# Altium schematic sheet drive_circuit.SchDoc
size A; SheetNumber: 1; SheetTotal: 1
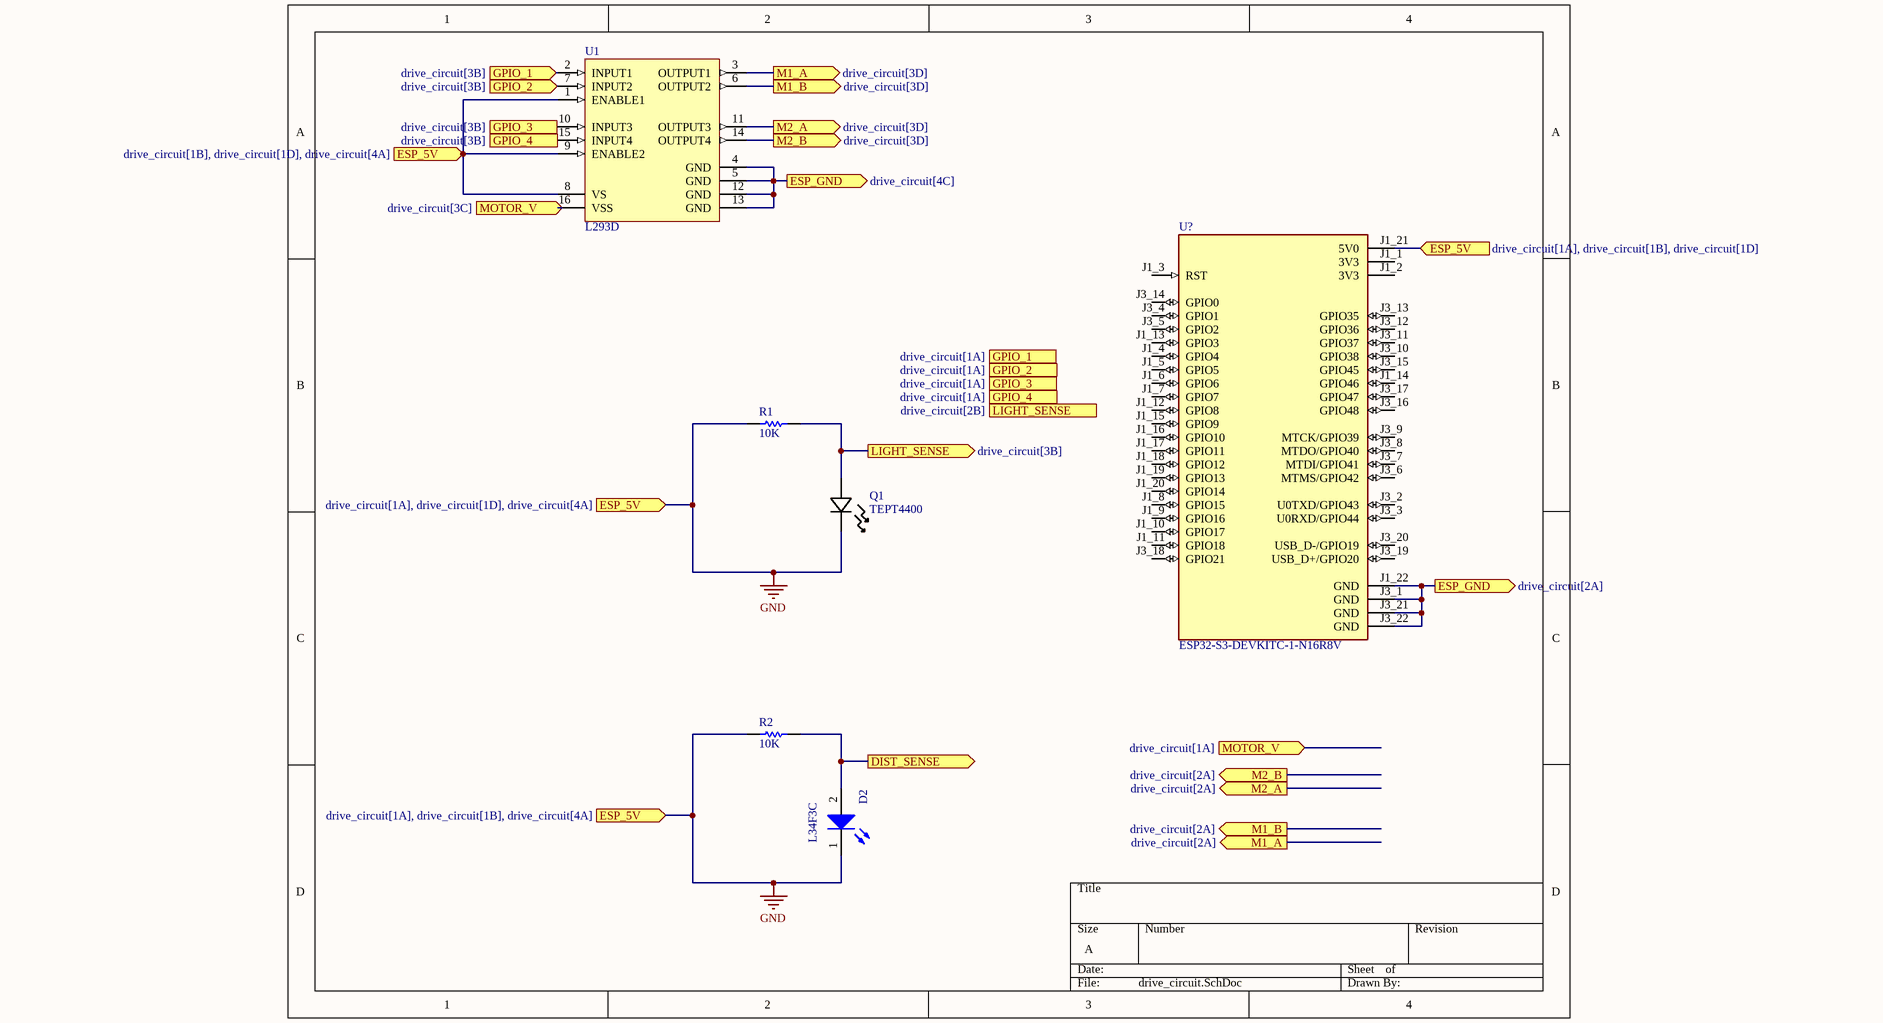
[diagram p0: drive_circuit.SchDoc]

## Parts
D2  L34F3C  [WL-TIRW_D3.9H5.3]
Q1  TEPT4400  [LED_TEPT4400_VIS]
R1  value 10K  (hidden comment: Resistor)
R2  value 10K  (hidden comment: Resistor)
U1  L293D  [STM-L293D-16]
U?  ESP32-S3-DEVKITC-1-N16R8V  [XCVR_ESP32-S3-DEVKITC-1-N16R8V]

## Ports
DIST_SENSE (out), ESP_5V (in, see drive_circuit[1A], drive_circuit[1B], drive_circuit[1D]), ESP_5V (in, see drive_circuit[1A], drive_circuit[1B], drive_circuit[4A]), ESP_5V (in, see drive_circuit[1A], drive_circuit[1D], drive_circuit[4A]), ESP_5V (in, see drive_circuit[1B], drive_circuit[1D], drive_circuit[4A]), ESP_GND (out, see drive_circuit[2A]), ESP_GND (out, see drive_circuit[4C]), GPIO_1 (in, see drive_circuit[1A]), GPIO_1 (in, see drive_circuit[3B]), GPIO_2 (in, see drive_circuit[1A]), GPIO_2 (in, see drive_circuit[3B]), GPIO_3 (see drive_circuit[1A]), GPIO_3 (see drive_circuit[3B]), GPIO_4 (see drive_circuit[1A]), GPIO_4 (see drive_circuit[3B]), LIGHT_SENSE (out, see drive_circuit[2B]), LIGHT_SENSE (out, see drive_circuit[3B]), M1_A (out, see drive_circuit[2A]), M1_A (out, see drive_circuit[3D]), M1_B (out, see drive_circuit[2A]), M1_B (out, see drive_circuit[3D]), M2_A (out, see drive_circuit[2A]), M2_A (out, see drive_circuit[3D]), M2_B (out, see drive_circuit[2A]), M2_B (out, see drive_circuit[3D]), MOTOR_V (in, see drive_circuit[1A]), MOTOR_V (in, see drive_circuit[3C])

## Nets
GND: D2.1(K) Q1.1 R1.1 R2.1 U1.1(ENABLE1) U1.8(VS) U1.9(ENABLE2) U?.J1_21(5V0) ; port ESP_5V
DIST_SENSE: D2.2(A) R2.2 ; port DIST_SENSE
ESP_GND: U1.4(GND) U1.5(GND) U1.12(GND) U1.13(GND) U?.J1_22(GND) U?.J3_1(GND) U?.J3_21(GND) U?.J3_22(GND) ; port ESP_GND
GPIO_1: U1.2(INPUT1) ; port GPIO_1
GPIO_2: U1.7(INPUT2) ; port GPIO_2
GPIO_4: U1.15(INPUT4) ; port GPIO_4
LIGHT_SENSE: Q1.2 R1.2 ; port LIGHT_SENSE
M1_A: U1.3(OUTPUT1) ; port M1_A
M1_B: U1.6(OUTPUT2) ; port M1_B
M2_A: U1.11(OUTPUT3) ; port M2_A
M2_B: U1.14(OUTPUT4) ; port M2_B
MOTOR_V: U1.16(VSS) ; port MOTOR_V

Not connected (* = marked no-connect by the designer): U1 10(INPUT3); U? J1_1(3V3) J1_2(3V3) J1_3(RST) J1_4(GPIO4) J1_5(GPIO5) J1_6(GPIO6) J1_7(GPIO7) J1_8(GPIO15) J1_9(GPIO16) J1_10(GPIO17) J1_11(GPIO18) J1_12(GPIO8) J1_13(GPIO3) J1_14(GPIO46) J1_15(GPIO9) J1_16(GPIO10) J1_17(GPIO11) J1_18(GPIO12) J1_19(GPIO13) J1_20(GPIO14) J3_2(U0TXD/GPIO43) J3_3(U0RXD/GPIO44) J3_4(GPIO1) J3_5(GPIO2) J3_6(MTMS/GPIO42) J3_7(MTDI/GPIO41) J3_8(MTDO/GPIO40) J3_9(MTCK/GPIO39) J3_10(GPIO38) J3_11(GPIO37) J3_12(GPIO36) J3_13(GPIO35) J3_14(GPIO0) J3_15(GPIO45) J3_16(GPIO48) J3_17(GPIO47) J3_18(GPIO21) J3_19(USB_D+/GPIO20) J3_20(USB_D-/GPIO19)

## Library data of the parts
D2 = CMP-03913-82270983-2: WL-TIRW THT Infrared Round Waterclear; Manufacturer Lifecycle Status: ACTIVE; Forward Current: 1A; Wavelength: 850nm; YEOL: 1 = Estimated lifetime > 10 years; Viewing Angle: 35°; Max Reverse Voltage (DC): 5V; Forward Voltage: 1.5V; Length: 3mm; Width: 2.54mm; Height: 5.3mm; Peak Wavelength: 850nm; RoHS: Compliant; Max Operating Temperature: 85°C; Min Operating Temperature: -40°C; Lifecycle Status: Production; Packaging: Bulk
Q1 = TEPT4400: PHOTO TRANS. 3MM  30DEG-e4; Manufacturer_Name: Vishay; Copyright: Copyright (C) 2026 Ultra Librarian. All rights reserved.; Manufacturer_Part_Number: TEPT4400; Datasheet: https://www.vishay.com/doc?81341
R1 R2 = Resistor: TC1: 0; SimulationGenericComponent: True; TC2: 0
U1 = CMP-2000-06524-1: Push-Pull Four Channel Driver with Diode, 4.5 to 36 V, -40 to 150 degC, 16-Pin PDIP, RoHS, Tube; Manufacturer: STMicroelectronics; Number of Outputs: 4; Current - Peak Output: 1.2A; Current - Output / Channel: 600mA; Input Type: Non-Inverting; Other Related Documents: L293DViewAllSpecifications; Dynamic Catalog: HalfBridge; Voltage - Supply: 4.5V~36V; Other Names: 497-2936-5; Package / Case: 16-DIP(0.300",7.62mm); PartNumber: L293D; Operating Temperature: -40°C~150°C; Datasheet URL: http://www.st.com/st-web-ui/static/active/en/resource/technical/document/datasheet/CD00000059.pdf; Supplier Device Package: 16-PowerDIP; Packaging: Tube; Package Description: 16-Pin Thru-Hole Dual-In-Line, Body 20 x 6.85 mm, Pitch 2.54 mm; Standard Package: 25; Datasheet Version: 07/2003; On-State Resistance: -; Manufacturer URL: http://www.st.com/; Category: IntegratedCircuits(ICs); Family: PMIC-MOSFET,BridgeDrivers-InternalSwitch; Type: HalfBridge; Series: -; Mounting Technology: ThroughHole; Package Reference: DIP-16; Mounting Type: ThroughHole
U? = ESP32-S3-DEVKITC-1-N16R8V: Development Boards & Kits - Wireless Gen-Purpose Dev Board, embeds ESP32-S3-WROOM-2-N16R8V, 16 MB Octal Flash, 8 MB Octal PSRAM, with Pin Header; MF: Espressif Systems; SnapEDA_Link: https://www.snapeda.com/parts/ESP32-S3-DEVKITC-1-N16R8V/Espressif+Systems/view-part/?ref=snap; Package: None; Value: *; MP: ESP32-S3-DEVKITC-1-N16R8V; Check_prices: https://www.snapeda.com/parts/ESP32-S3-DEVKITC-1-N16R8V/Espressif+Systems/view-part/?ref=eda